# Altium project ESP_12F_CLOCK_MAXTRIX.PrjPcb
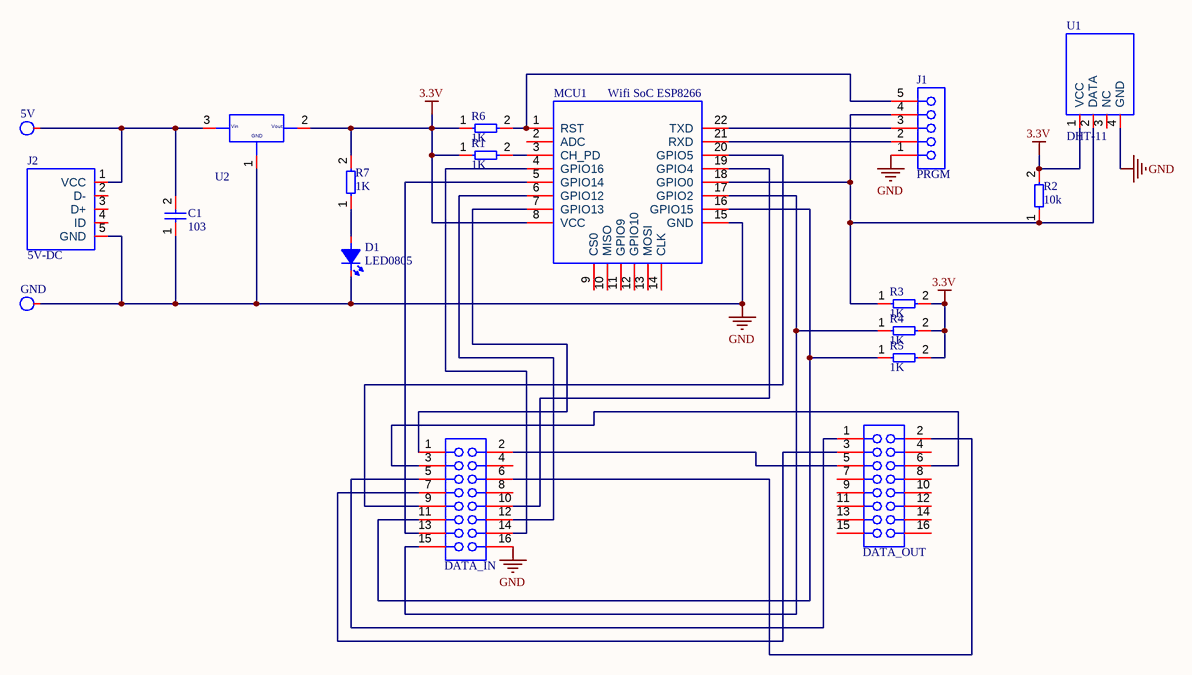
[diagram p0: ESP_12F_CLOCK_MAXTRIX.SchDoc]
1 sheet, 18 parts. Net scope: global (net labels, ports and power ports of the same name join across sheets).
Board files: ESP_12F_CLOCK_MAXTRIX.PcbDoc, ESP_12F_CLOCK_MAXTRIX_V1.PcbDoc

## Sheet ESP_12F_CLOCK_MAXTRIX.SchDoc
size A4; SheetNumber: 1; SheetTotal: 1

### Parts
5V  SolderPoint  [SolderPoint]  (value not drawn)
C1  103  [C0805]
D1  LED0805  [L0805RED]
DATA_IN  DATA_IN  [Header 8x2 TH Pitch 2.54mm]  (value not drawn)
DATA_OUT  DATA_OUT  [Header 8x2 TH Pitch 2.54mm]  (value not drawn)
GND  SolderPoint  [SolderPoint]  (value not drawn)
J1  PRGM  [Header 5x1 TH Pitch 2.54mm]
J2  5V-DC  [Micro USB 01]
MCU1  Wifi SoC ESP8266  [ESP-12F]
R1  1K  [R0805]
R2  10k  [R0805]
R3  1K  [R0805]
R4  1K  [R0805]
R5  1K  [R0805]
R6  1K  [R0805]
R7  1K  [R0805]
U1  DHT-11  [DHT-11]
U2  AMS1117  [SOT223-3]  (value not drawn)

### Nets
3.3V: MCU1.8(VCC) R1.1 R2.2 R3.2 R4.2 R5.2 R6.1 R7.2 U1.1(VCC) U2.2
GND: C1.1 D1.2(K) DATA_IN.16 GND.1 J1.1 J2.5(GND) MCU1.15(GND) U1.4(GND) U2.1
Net5V_1: 5V.1 C1.2 J2.1(VCC) U2.3
NetD1_1: D1.1(A) R7.1
NetDATA_IN_1: DATA_IN.1 MCU1.7(GPIO13)
NetDATA_IN_2: DATA_IN.2 DATA_OUT.5
NetDATA_IN_3: DATA_IN.3 DATA_OUT.6
NetDATA_IN_5: DATA_IN.5 DATA_OUT.1
NetDATA_IN_6: DATA_IN.6 DATA_OUT.2
NetDATA_IN_7: DATA_IN.7 DATA_OUT.3
NetDATA_IN_9: DATA_IN.9 MCU1.20(GPIO5)
NetDATA_IN_10: DATA_IN.10 MCU1.19(GPIO4)
NetDATA_IN_11: DATA_IN.11 MCU1.16(GPIO15) R5.1
NetDATA_IN_12: DATA_IN.12 MCU1.6(GPIO12)
NetDATA_IN_13: DATA_IN.13 MCU1.5(GPIO14)
NetDATA_IN_14: DATA_IN.14 MCU1.4(GPIO16)
NetDATA_IN_15: DATA_IN.15 MCU1.17(GPIO2) R4.1
NetJ1_2: J1.2 MCU1.21(RXD)
NetJ1_3: J1.3 MCU1.22(TXD)
NetJ1_4: J1.4 MCU1.18(GPIO0) R2.1 R3.1 U1.2(DATA)
NetJ1_5: J1.5 MCU1.1(RST) R6.2
NetMCU1_3: MCU1.3(CH_PD) R1.2

Not connected (* = marked no-connect by the designer): DATA_IN 4 8; DATA_OUT 4 7 8 9 10 11 12 13 14 15 16; J2 2(D-) 3(D+) 4(ID); MCU1 2(ADC) 9(CS0) 10(MISO) 11(GPIO9) 12(GPIO10) 13(MOSI) 14(CLK); U1 3(NC)

### Notes on the sheet
- (in symbol AMS1117(SOT-223)) Vin; Vout; GND

### Library data of the parts
C1 = C0805
DATA_IN DATA_OUT = Header 8x2 TH Pitch 2.54mm
J1 = Header 5x1 TH Pitch 2.54mm
J2 = Micro USB (AB 2.0)
MCU1 = ESP-12F
R1-R7 = Resistor SMD
U2 = AMS1117(SOT-223)